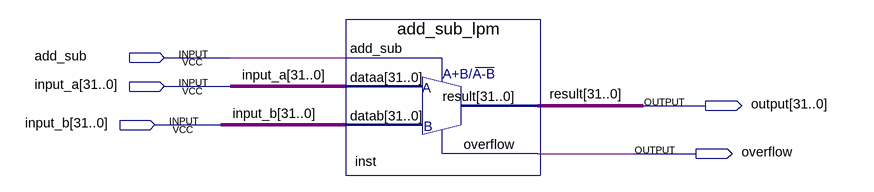
[diagram p0: schematic sheet]
// Quartus schematic add_sub.bdf as structural Verilog: 1 symbols, 5 pins
module add_sub (
  input  add_sub,
  input  [31:0] input_a,
  input  [31:0] input_b,
  output [31:0] \output ,
  output overflow
);

  add_sub_lpm inst (.add_sub(add_sub), .dataa(input_a), .datab(input_b), .result(\output ), .overflow(overflow));

  // Other names for the same wires on the sheet: result[31:0] = \output 
endmodule
